# EasyEDA schematic SCH_test_TGT_2024-01-07.json
TITLE: TGT test circuit; REV: 1.0; Date: 2024-01-07; Sheet: 1/1; Drawn By: svenhancock; Company: TBAG
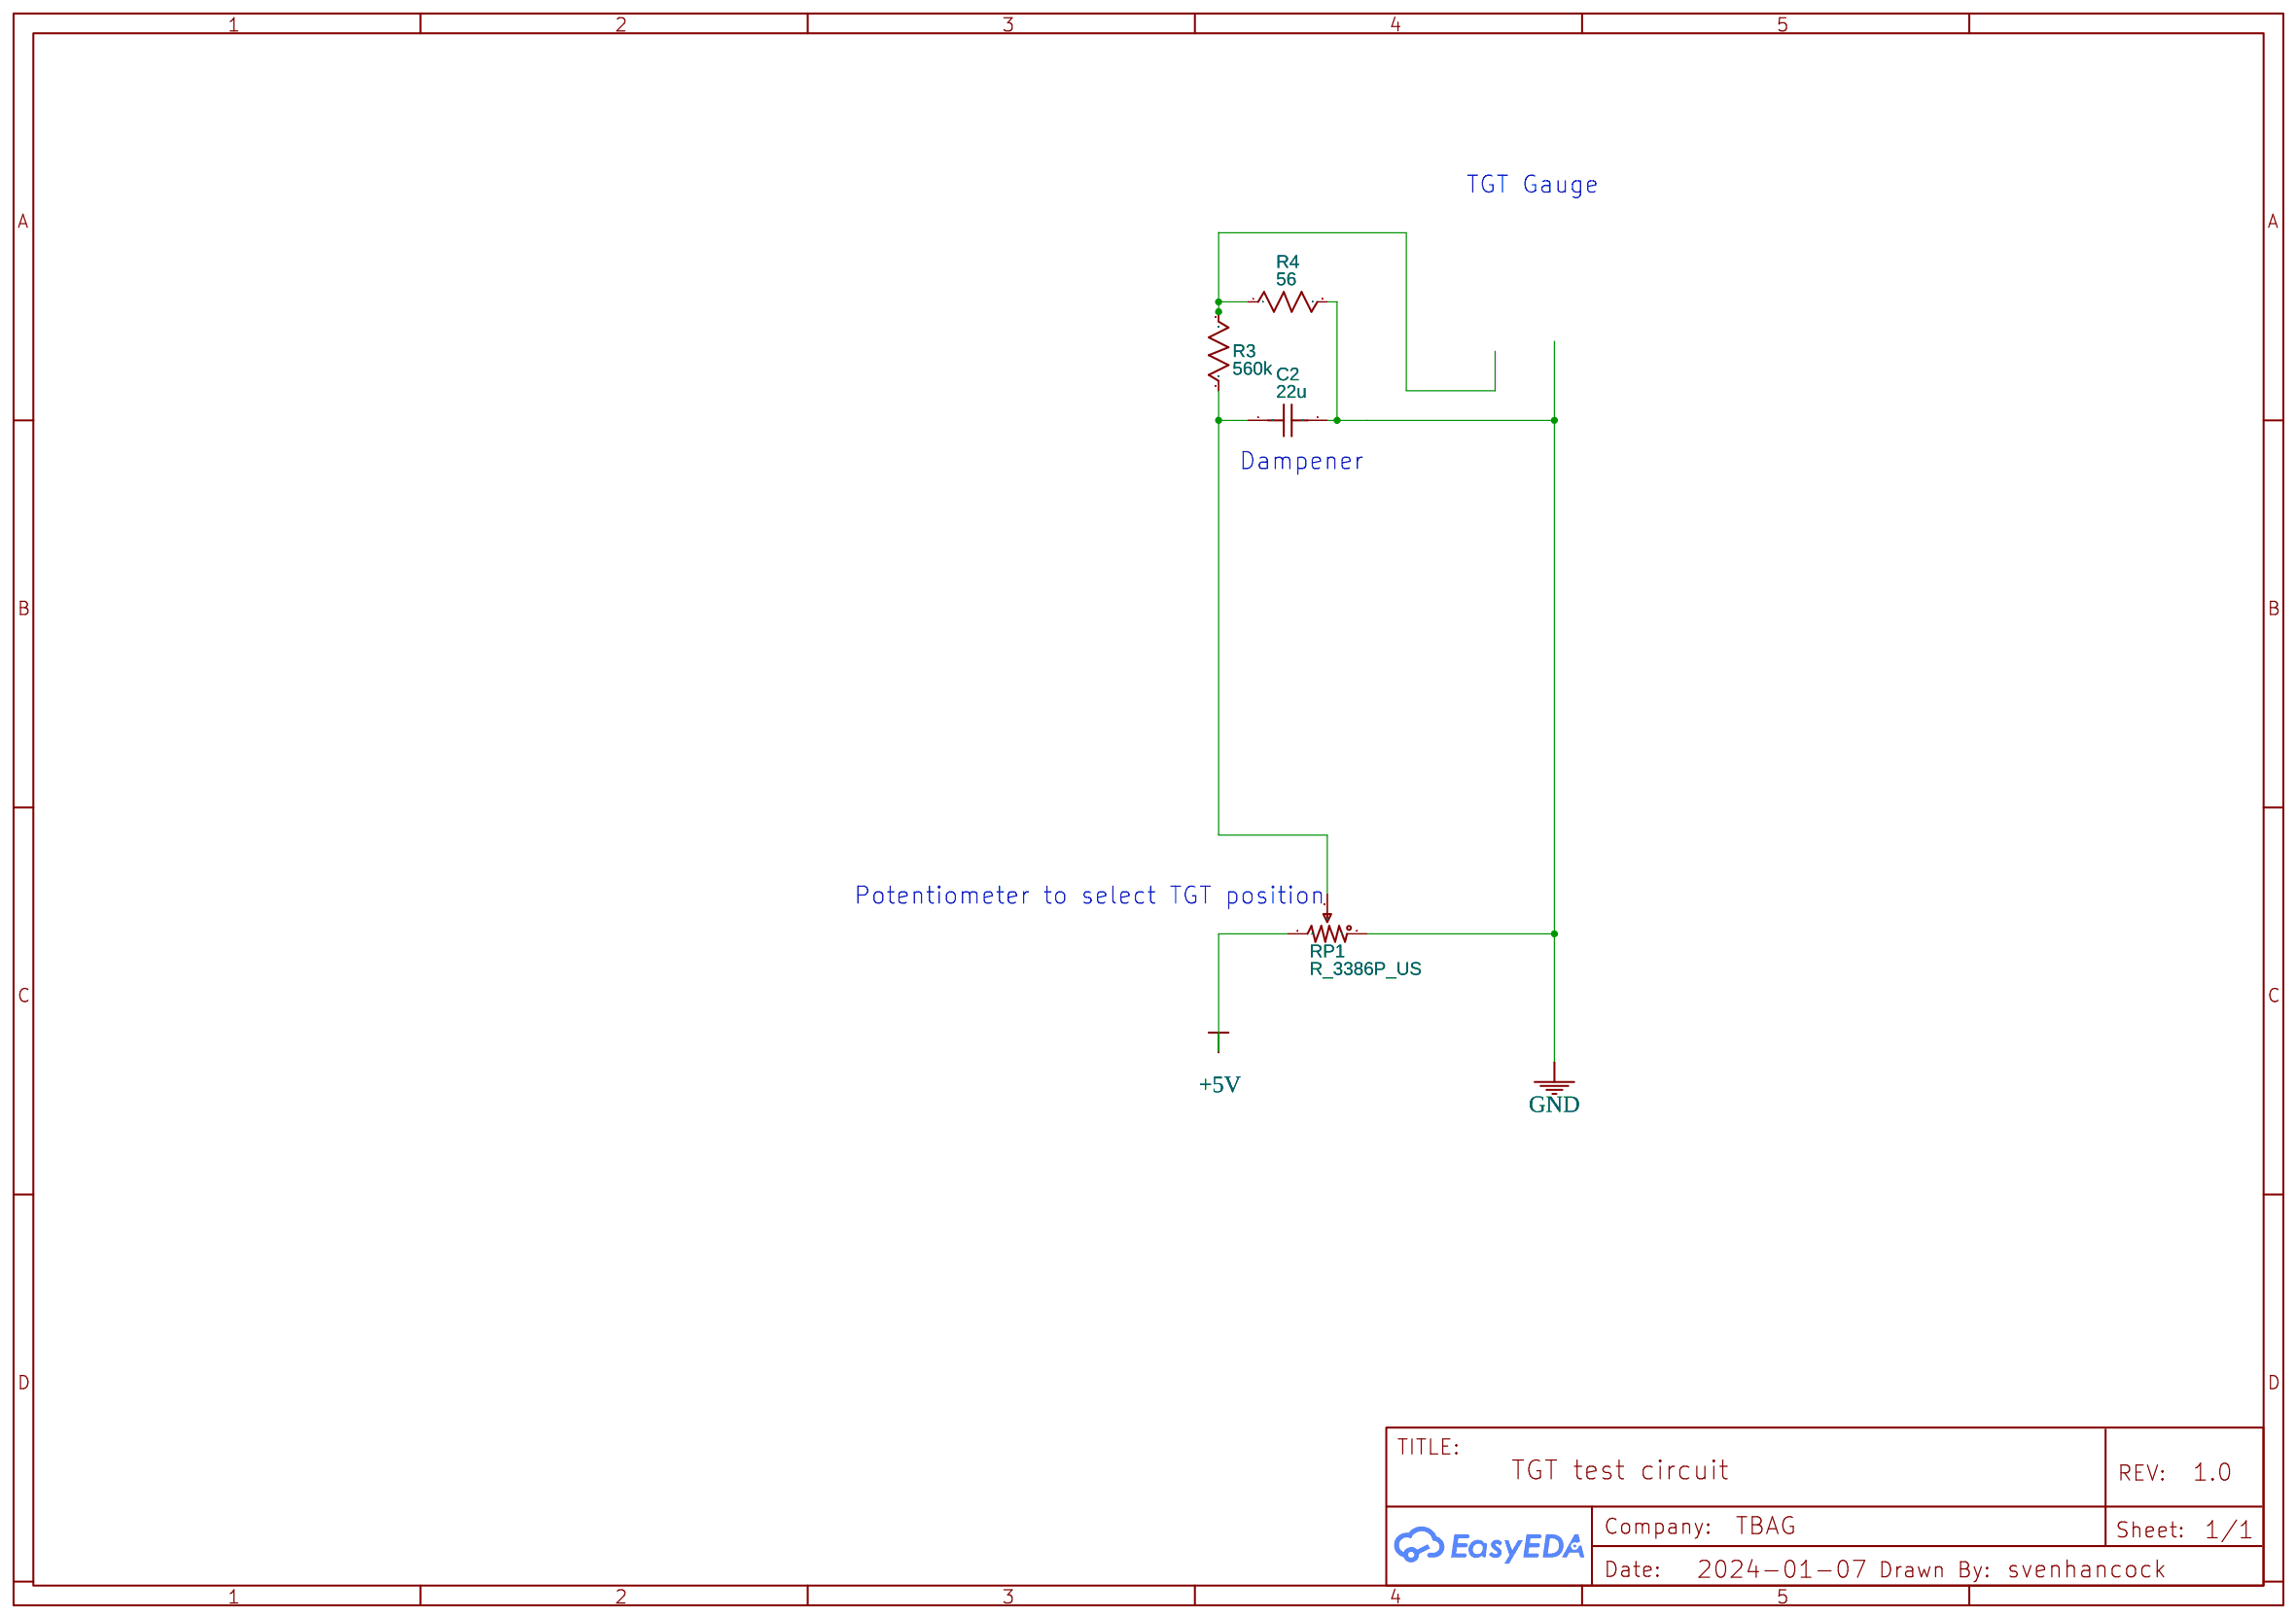
[diagram p0: schematic sheet]

## Parts
C2  22u  [C0603]
R3  560k  [R0603]
R4  56  [R0603]
RP1  R_3386P_US  [RES-ADJ-TH_3386P]

## Library data of the parts
C2 = C_0603_US: Contributor: LCEDA_Lib
R3 R4 = R_0603_US: Contributor: LCEDA_Lib
RP1 = R_3386P_US: Supplier: LCSC; Contributor: LCEDA_Lib; value(Ω): 10K

## Nets
+5V: RP1.3
GND: C2.2 R4.2 RP1.1
Net-(C2-1): C2.1 R3.1 RP1.2
Net-(R3-2): R3.2 R4.1

## Notes on the sheet
- TGT Gauge
- Dampener
- Potentiometer to select TGT position
